# EAGLE design SparkFun_QRE1113_Line_Sensor_Breakout_Digital (EAGLE 7.5.0)
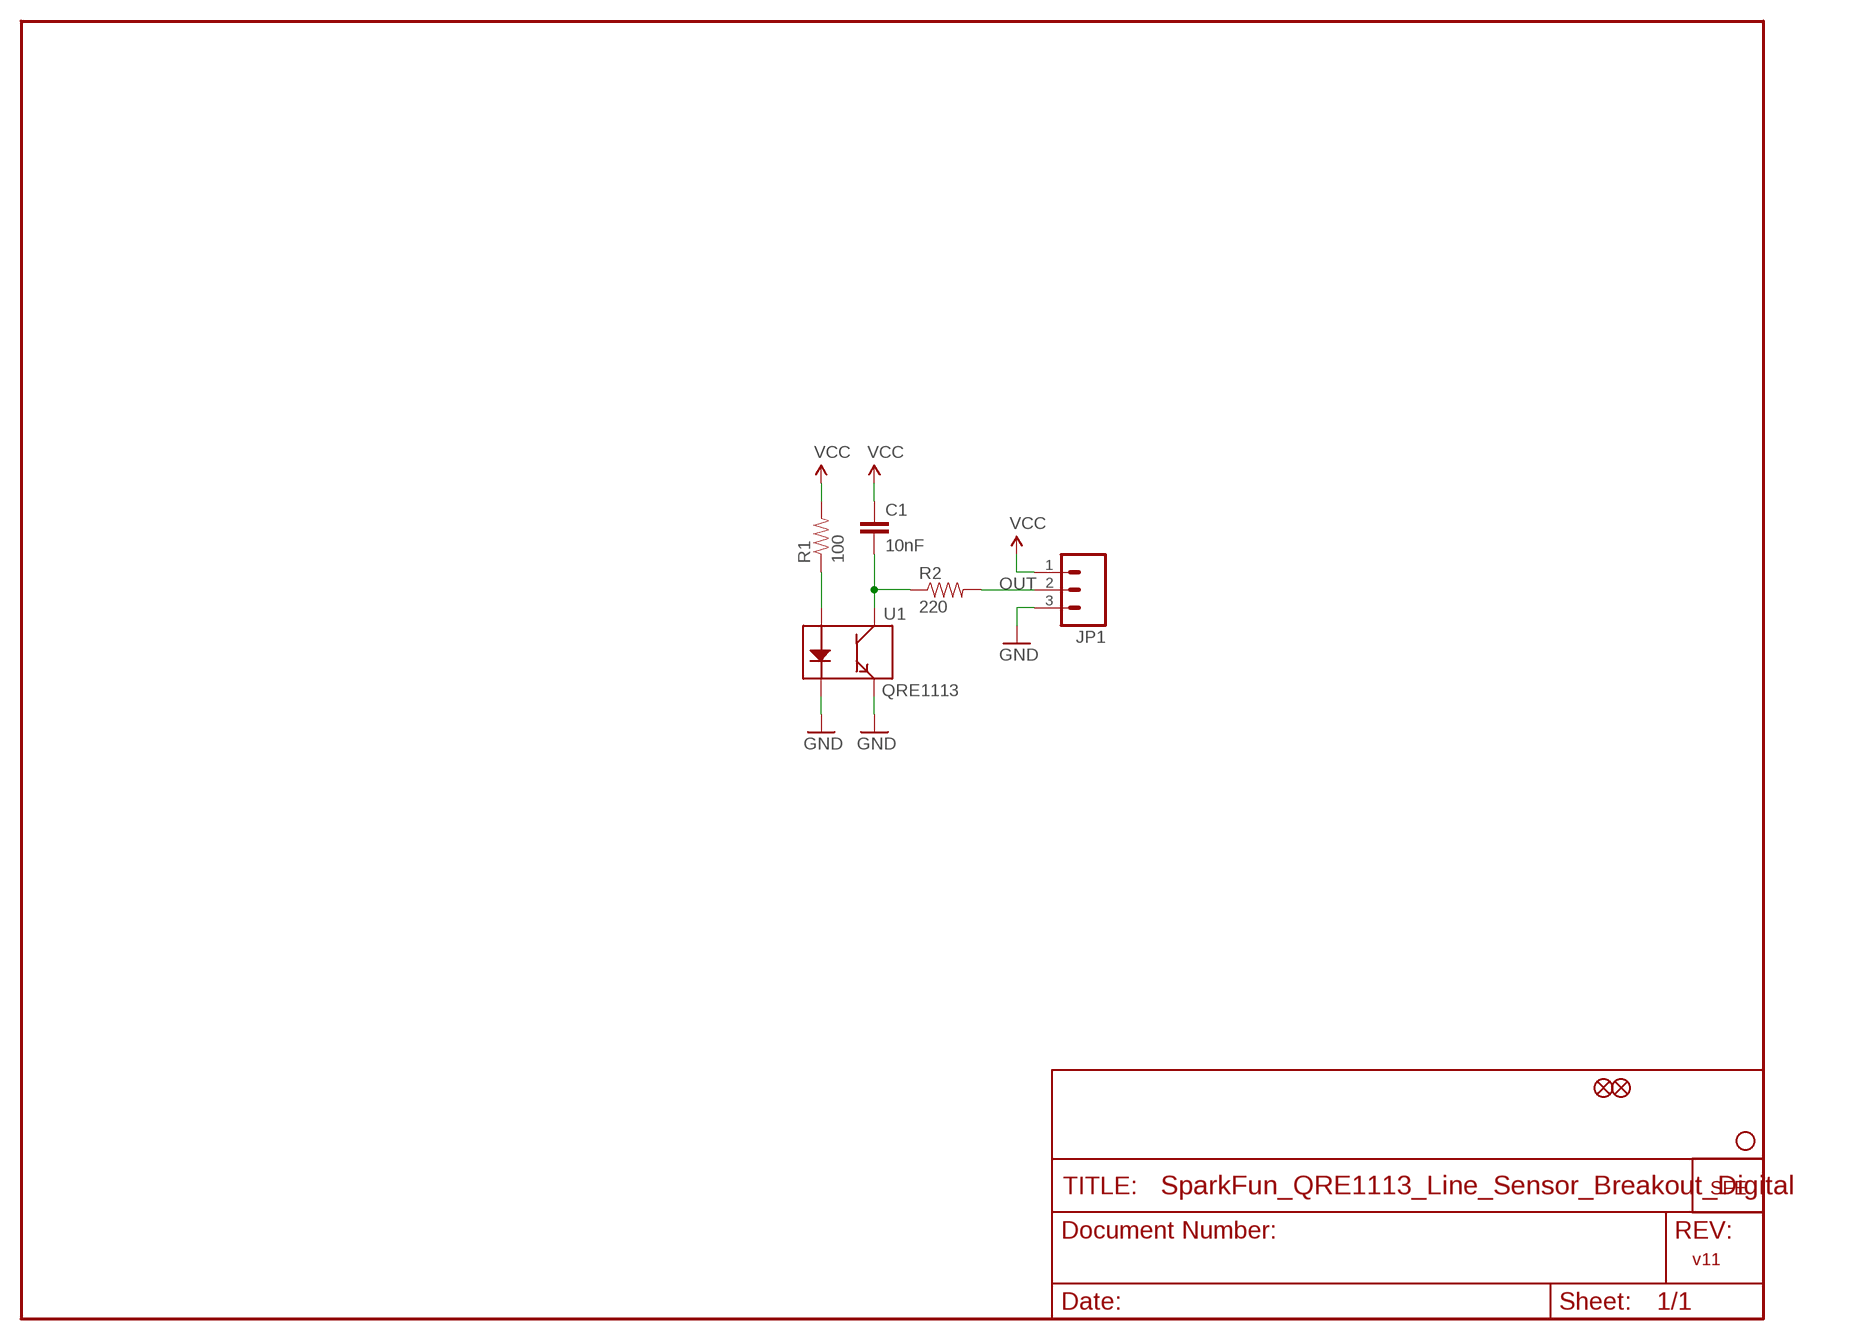
[diagram p0: schematic, sheet 1]

## Parts
C1  10nF  CAP0402-CAP  [0402-CAP]
FID1  FIDUCIALUFIDUCIAL  [MICRO-FIDUCIAL]
FID2  FIDUCIALUFIDUCIAL  [MICRO-FIDUCIAL]
JP1  M03PTH  [1X03]
JP2  LOGO-SFESK  [SFE-LOGO-FLAME]
JP3  STAND-OFF  [STAND-OFF]
R1  100  RESISTOR0402-RES  [0402-RES]
R2  220  RESISTOR0402-RES  [0402-RES]
U1  QRE1113  [QRE1113]

## Nets
GND: JP1.3 U1.2(K) U1.4(E)
N$1: R1.1 U1.1(A)
OUT: JP1.2 R2.2
OUT1: C1.2 R2.1 U1.3(C)
VCC: C1.1 JP1.1 R1.2

## Notes on the sheet
- v11

## Library data of the parts
C1 = SparkFun:CAP: Capacitor Standard 0603 ceramic capacitor, and 0.1" leaded capacitor.
FID1 FID2 = SparkFun-Aesthetics:FIDUCIAL: Fiducial Alignment Points Various fiducial points for machine vision alignment.
JP1 = SparkFun:M03: Header 3 Standard 3-pin 0.1" header. Use with straight break away headers (SKU : PRT-00116), right angle break away headers (PRT-00553), swiss pins (PRT-00743), machine pins (PRT-00117), and female headers (PRT-00115). Molex polarized connector foot print use with SKU : PRT-08232 with associated crimp pins and housings.
JP2 = SparkFun:LOGO-SFE: Spark Fun Electronics PCB Logo This is the standard Spark Fun Electronics PCB logo.
JP3 = SparkFun:STAND-OFF: Stand Off This is the mechanical footprint for a #4 phillips button head screw. Use the keepout ring to avoid running the screw head into surrounding components. SKU : PRT-00447
R1 R2 = SparkFun:RESISTOR: Resistor Basic schematic elements and footprints for 0603, 1206, and PTH 1/10th watt (small) resistors.
U1 = SparkFun:QRE1113

## Board
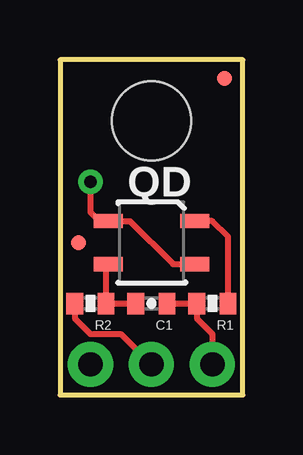
[diagram p1: board, top side]
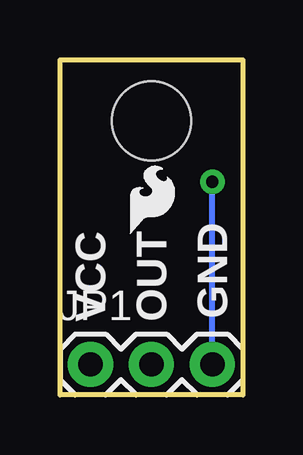
[diagram p2: board, bottom side, seen from below]

Size 7.62 x 13.97 mm. Coordinates in mm from the lower left corner, seen from the top.
Outline: 0,0 7.62,0 7.62,13.97 0,13.97 0,0
Copper layers (1*16): Top 0.035mm / dielectric 1.5mm / Bottom 0.035mm
Design rules "SparkFun": minimum track width 8mil, minimum drill 20mil, track to track 8mil, track to pad 8mil, pad to pad 8mil, via to via 8mil, smd to smd 8mil, copper to edge 9mil, drill to drill 8mil, minimum pad ring 12mil, minimum via ring 10mil, stop-mask expansion 4mil, vias tented up to drill 20mil, thermal gap 10mil

### Footprints (pad centres in the part's own frame; a part is rotated, then mirrored left to right if it is on the bottom)
0402-CAP = smd 0.7 x 0.9: 1 -0.65,0; 2 0.65,0
MICRO-FIDUCIAL = smd 0.635 x 0.635: 1 0,0
1X03 = drill 1.016 pad 1.88: 1 0,0; 2 2.54,0; 3 5.08,0
STAND-OFF = hole 3.302: 0,0
0402-RES = smd 0.7 x 0.9: 1 -0.65,0; 2 0.65,0
QRE1113 = smd 1.2 x 0.6: 1 -1.8,-0.9; 2 1.8,-0.9; 3 1.8,0.9; 4 -1.8,0.9

### Placement (x,y rotation side)
C1  3.81,3.81 180 top
FID1  6.86,13.21 0 top
FID2  0.76,6.35 0 top
JP1  6.35,1.27 0 bottom
JP2  4.7,6.73 0 bottom
JP3  3.81,11.43 0 top
R1  6.35,3.81 180 top
R2  1.27,3.81 180 top
U1  3.81,6.35 180 top

### Tracks (layer width: path | path; a pad name or v marks a point on that pad's centre or on a via)
GND  (via drill 0.51)
  Top 0.254: U1.4 4.71,5.45 2.91,7.25 U1.2 1.64,7.25 1.27,7.62 v1.27,8.89
  Bottom 0.254: JP1.3 v1.27,8.89
N$1
  Top 0.254: U1.1 6.35,7.25 7,6.6 R1.1
OUT
  Top 0.254: R2.2 0.62,3.19 1.27,2.54 2.54,2.54 JP1.2
OUT1
  Top 0.254: C1.2 R2.1 1.92,5.36 U1.3
VCC
  Top 0.254: C1.1 R1.2 5.7,3.19 6.35,2.54 JP1.1

### Text on the board
tPlace: QD
bPlace: GND | OUT | VCC